# Altium schematic sheet Wiring.SchDoc
size A4; PageSetup: Record=PageOptions|CenterHorizontal=True|CenterVertical=True|PrintScale=1.00|XCorrection=1.00|YCorrection=1.00|PrintKind=0|BorderSize=5000000|LeftOffset=0|BottomOffset=0|Orientation=2|PaperLength=1000|PaperWidth=1000|Scale=100|PaperSource=7|PrintQuality=-3|MediaType=1|DitherType=10|PrintScaleMode=1|PaperKind=A4|PaperIndex=9
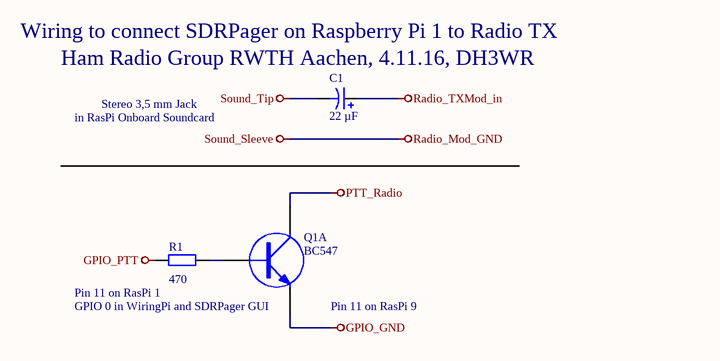
[diagram p0: Wiring.SchDoc]

## Parts
C1  value 22 µF  [RB7.6-15]  (hidden comment: Cap Pol1)
Q1  BC547  [SOT363]  (part A of 2)
R1  value 470  [AXIAL-0.4]  (hidden comment: Res2)

## Nets
GPIO_GND: Q1.1(E1)
GPIO_PTT: R1.1
PTT_Radio: Q1.6(C1)
Radio_TXMod_in: C1.1
Sound_Tip: C1.2
NetQ1_2: Q1.2(B1) R1.2

## Notes on the sheet
- Wiring to connect SDRPager on Raspberry Pi 1 to Radio TX
- (near C1) Ham Radio Group RWTH Aachen, 4.11.16, DH3WR
- in RasPi Onboard Soundcard
- Stereo 3,5 mm Jack
- (near R1) Pin 11 on RasPi 1
- (near Q1) GPIO 0 in WiringPi and SDRPager GUI
- (near Q1) Pin 11 on RasPi 9

## Library data of the parts
C1 = Cap Pol1: Polarized Capacitor (Radial); Published: 8-Jun-2000; LatestRevisionDate: 17-Jul-2002; LatestRevisionNote: Re-released for DXP Platform.; PackageReference: RB7.6-15; Publisher: Altium Limited; PackageDescription: Polarized Capacitor (Radial); 2 Leads
Q1 = BC847S: NPN Transistor
R1 = Res2: Resistor; Published: 8-Jun-2000; LatestRevisionDate: 17-Jul-2002; LatestRevisionNote: Re-released for DXP Platform.; PackageReference: AXIAL-0.4; Publisher: Altium Limited; PackageDescription: Axial Device, Thru-Hole; 2 Leads; 0.4 in Pin Spacing